# Altium schematic sheet CAN.SchDoc
size A4; SheetNumber: 6; SheetTotal: 6
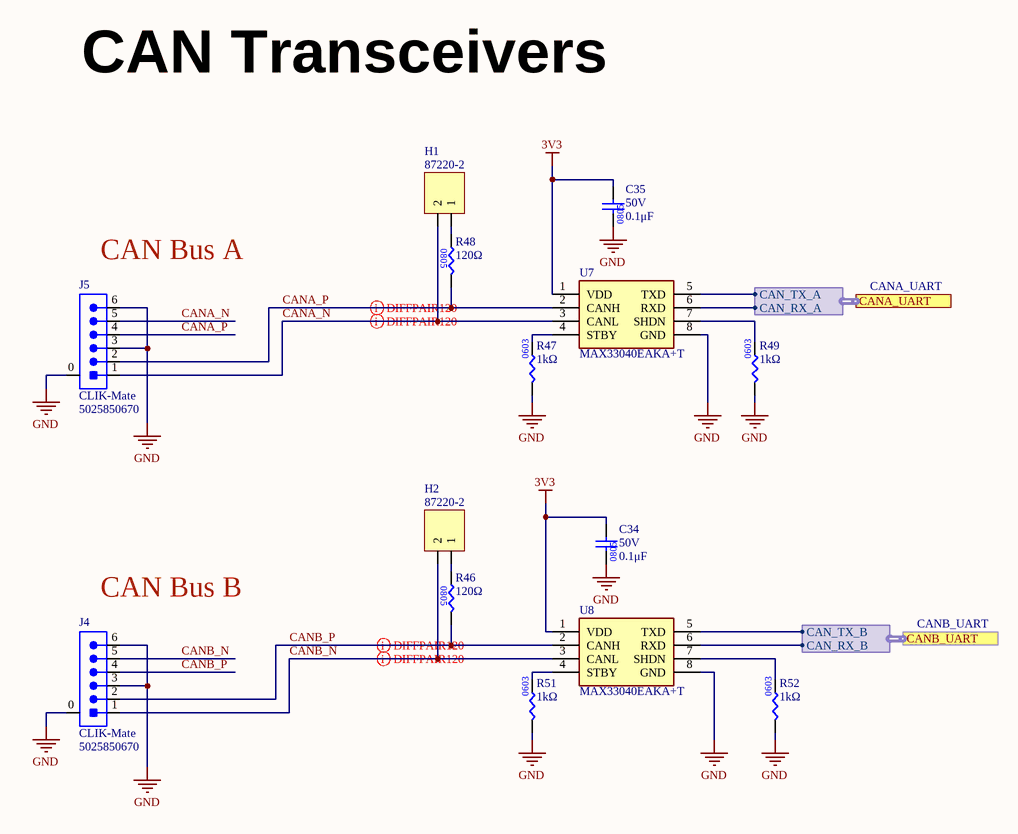
[diagram p0: CAN.SchDoc]

## Parts
C34  value 0.1μF  Voltage Rating: 50V  [CAP2012]  (hidden comment: CAP_0.1uF_50V_0805)
C35  value 0.1μF  Voltage Rating: 50V  [CAP2012]  (hidden comment: CAP_0.1uF_50V_0805)
H1  Manufacturer Part Number 1: 87220-2  [HDR1X2]  (hidden comment: JUMPER_2)
H2  Manufacturer Part Number 1: 87220-2  [HDR1X2]  (hidden comment: JUMPER_2)
J4  Family: CLIK-Mate  Manufacturer Part Number 1: 5025850670  [MOLEX-5025850670]  (hidden comment: CON_6M_SM_RA_1.5mm)
J5  Family: CLIK-Mate  Manufacturer Part Number 1: 5025850670  [MOLEX-5025850670]  (hidden comment: CON_6M_SM_RA_1.5mm)
R46  value 120Ω  [RES0805]  (hidden comment: RES_120Ω_0805_1%)
R47  value 1kΩ  [RES0603]  (hidden comment: RES_1kΩ_0603_5%)
R48  value 120Ω  [RES0805]  (hidden comment: RES_120Ω_0805_1%)
R49  value 1kΩ  [RES0603]  (hidden comment: RES_1kΩ_0603_5%)
R51  value 1kΩ  [RES0603]  (hidden comment: RES_1kΩ_0603_5%)
R52  value 1kΩ  [RES0603]  (hidden comment: RES_1kΩ_0603_5%)
U7  MAX33040EAKA+T  [SOT65P280X145-8N]
U8  MAX33040EAKA+T  [SOT65P280X145-8N]

## Ports
CANA_UART (harness CANA_UART), CANB_UART (harness CANB_UART)

## Harnesses
CANA_UART: CAN_RX_A, CAN_TX_A
CANB_UART: CAN_RX_B, CAN_TX_B

## Nets
3V3: C34.2 C35.2 U7.1(VDD) U8.1(VDD)
GND: C34.1 C35.1 J4.0 J4.3 J4.6 J5.0 J5.3 J5.6 R47.1 R49.1 R51.1 R52.1 U7.8(GND) U8.8(GND)
CANA_N: H1.2 J5.1 J5.5 U7.3(CANL)
CANA_P: J5.2 J5.4 R48.2 U7.2(CANH)
CANB_N: H2.2 J4.1 J4.5 U8.3(CANL)
CANB_P: J4.2 J4.4 R46.2 U8.2(CANH)
NetH1_1: H1.1 R48.1
NetH2_1: H2.1 R46.1
NetR47_2: R47.2 U7.4(STBY)
NetR49_2: R49.2 U7.7(SHDN)
NetR51_2: R51.2 U8.4(STBY)
NetR52_2: R52.2 U8.7(SHDN)
NetU7_5: U7.5(TXD) ; port CANA_UART.CAN_TX_A
NetU7_6: U7.6(RXD) ; port CANA_UART.CAN_RX_A
NetU8_5: U8.5(TXD) ; port CANB_UART.CAN_TX_B
NetU8_6: U8.6(RXD) ; port CANB_UART.CAN_RX_B

## Layout directives
differential pair; differential pair class CAN120: CANA_N, CANA_P, CANB_N, CANB_P

## Notes on the sheet
- CAN Transceivers
- (near J5) CAN Bus A
- (near J4) CAN Bus B

## Library data of the parts
C34 C35 = CAP_0.1uF_50V_0805: CAP CER 0.1UF 50V X7R 0805; Manufacturer Part Number 1: GCM21BR71H104KA37K; Manufacturer 1: Murata Electronics; Package/Footprint: 0805; Supplier Part Number 1: 490-8049-1-ND; Supplier 1: Digi-Key; Dielectric: X7R; LCSC Part #: C49678; Mounting Type: SMD
H1 H2 = JUMPER_2: HEADER 2X1; Manufacturer 1: TE Connectivity; Package/Footprint: TH; Supplier 1: Digi-Key; Supplier Part Number 1: A26542-ND; Mount: Through Hole; Mounting Type: TH
J4 J5 = CON_6M_SM_RA_1.5mm: CONN HEADER SMD RIGHT ANGLE 1.5 MM PITCH; Manufacturer 1: Molex; Supplier 1: Digi-Key; Supplier Part Number 1: WM12832CT-ND; Package/Footprint: SMD; Mounting Type: SMD
R46 R48 = RES_120Ω_0805_1%: RES 120 OHM 1% 1/8W 0805; Manufacturer 1: Vishay; Manufacturer Part Number 1: CRCW0805120RFKEA; Package/Footprint: 0805; Supplier Part Number 1: 541-120CCT-ND; Supplier 1: Digi-Key; LCSC Part #: C17437; Mounting Type: SMD
R47 R49 R51 R52 = RES_1kΩ_0603_5%: RES 1K OHM 5% 1/10W 0603; Manufacturer 1: Yageo; Manufacturer Part Number 1: RC0603JR-071KL; Package/Footprint: 0603; Supplier Part Number 1: 311-1.0KGRCT-ND; Supplier 1: Digi-Key; Mounting Type: SMD; LCSC Number: C14676
U7 U8 = MAX33040EAKA+T: Integrated Circuit; Manufacturer_Name: Maxim Integrated; Datasheet Link: https://datasheets.maximintegrated.com/en/ds/MAX33040E-MAX33041E.pdf; Height: 1.45mm; Mouser Part Number: 700-MAX33040EAKA+T; Mouser Price/Stock: https://www.mouser.co.uk/ProductDetail/Maxim-Integrated/MAX33040EAKA%2bT?qs=IS%252B4QmGtzzrp4y4r9nEH%252Bg%3D%3D; Manufacturer Part Number 1: MAX33040EAKA+T